# Altium schematic sheet ZeroDriftLatchComp.SchDoc: ZERO DRFT LTCH CMP
size A; PageSetup: Record=PageOptions|CenterHorizontal=True|CenterVertical=True|PrintScale=1.09|XCorrection=1.00|YCorrection=1.00|PrintKind=0|BorderSize=5000000|LeftOffset=0|BottomOffset=0|Orientation=2|PaperLength=1000|PaperWidth=1000|Scale=100|PaperSource=7|PrintQuality=-4|MediaType=1|DitherType=10|PaperKind=11" x 17"|PrintScaleMode=1; Organization: Analog Design Reference; DocumentNumber: 40000; Revision: 1; SheetNumber: 1
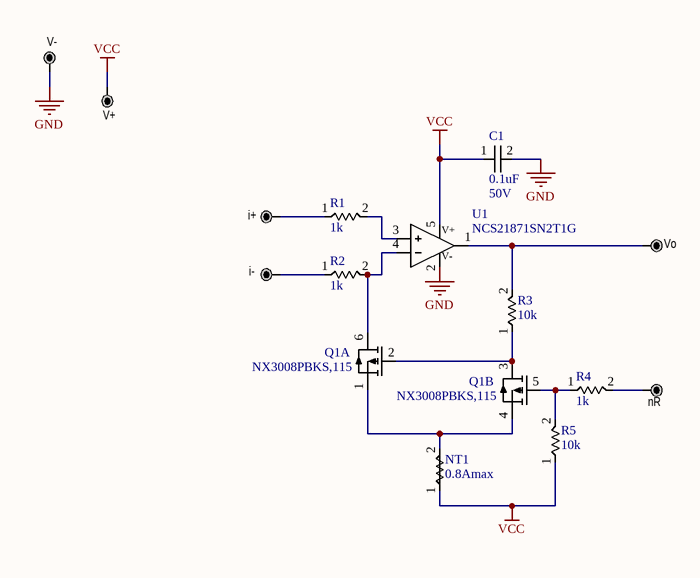
[diagram p0: ZeroDriftLatchComp.SchDoc]

## Parts
C1  0.1uF  Vendor Max Voltage: 50V  [0603 CAP]
i+  Test Point PTH  [TP - PTH]  (value not drawn)  (no BOM)
i-  Test Point PTH  [TP - PTH]  (value not drawn)  (no BOM)
nR  Test Point PTH  [TP - PTH]  (value not drawn)  (no BOM)
NT1  0.8Amax  [0603 NetTie]  (net tie, no BOM)
Q1  NX3008PBKS,115  [SOT363]  (parts A,B of 2)
R1  1k  [0603 RES]
R2  1k  [0603 RES]
R3  10k  [0603 RES]
R4  1k  [0603 RES]
R5  10k  [0603 RES]
U1  NCS21871SN2T1G  [SOT-23-5]
V+  Test Point PTH  [TP - PTH]  (value not drawn)  (no BOM)
V-  Test Point PTH  [TP - PTH]  (value not drawn)  (no BOM)
Vo  Test Point PTH  [TP - PTH]  (value not drawn)  (no BOM)

## Nets
GND: C1.2 U1.2(Vss) V-.1(TP)
VCC: C1.1 NT1.1 R5.1 U1.5(Vdd) V+.1(TP)
Neti+_1: i+.1(TP) R1.1
Neti-_1: i-.1(TP) R2.1
NetnR_1: nR.1(TP) R4.2
NetNT1_2: NT1.2 Q1.1(S) Q1.4(S)
NetQ1_2: Q1.2(G) Q1.3(D) R3.1
NetQ1_5: Q1.5(G) R4.1 R5.2
NetQ1_6: Q1.6(D) R2.2 U1.4
NetR1_2: R1.2 U1.3
NetR3_2: R3.2 U1.1 Vo.1(TP)

## Notes on the sheet
- Title
- Size:
- Date:
- A
- Number:
- Time:
- Revision:
- Sheet
- of
- File:
- (in symbol NCS21871SN2T1G) V+; V-

## Library data of the parts
C1 = C-0603-0u10-J50V-X7RC: CAP CER 0.1UF 50V X7R 0603; AltMPN1: C0603C104J5RACTU; AltMPN: GRM188R71H104JA93D; MPN: CC0603JRX7R9BB104; AltMfg1: KEMET; AltMfg: Murata; AVL: DigiKey, Mouser, Newark, Avnet, Arrow, Future, Allied, TTI, Heilind, Sager, Manufacturer Direct, Venkel; Mfg: Yageo; Tolerance: J-5%; Type: CERAMIC; Component: CAPACITOR; Value: 0.1uF; Temperature Coefficient: X7R; Design Ambient Temp (C): *; Design Ripple Current (A): *; Design Vmax RMS: *; MKS Derate Voltage (%): *; MKS Ripple Current (%): *; Vendor ESR: *; Vendor Max Power (W): *; Vendor Max Temp (C): *
i+ i- nR V+ V- Vo = Test Point PTH: PTH Test Point; VPN: *; MPN: *
NT1 = 0603_NetTie: RES 0 OHM 1/10W 1% 0603 SMD Thick Film Resistor; Newport PN: *; Value: 0.8Amax; HelpURL: http://www.smtnet.com/library/files/upload/NetTies-and-How-to-Use-Them.pdf
Q1 = NX3008PBKS,115: NX3008PBKS - 30 V, 200 mA dual P-channel Trench MOSFET; mfg: Nexperia; Supplier 1: Digi-Key; mpn: NX3008PBKS,115; RoHS: No; Stock 1: 86588; Pricing 1: 1=0.33000, 10=0.24800, 25=0.21720, 100=0.11780, 500=0.09610, 1000=0.07130 (USD); Supplier Part Number 1: 1727-1282-1-ND
R1 R2 R4 = R-0603-1K00-B-G: RES SMD 1K OHM 0.1% 1/10W 0603; MPN: RT0603BRB071KL; AltMPN: ERA-3AEB102V; AltMPN1: TFCR0603-10W-E-1001BT; Mfg: Yageo; AltMfg: Panasonic; Power: 0.1W; Tolerance: B-0.1%; AVL: DigiKey, Mouser, Newark, Avnet, Arrow, Future, Allied, TTI, Heilind, Sager, Manufacturer Direct, Venkel; AltMfg1: Venkel; HelpURL: G:\DATA\ISB Engineering\Electronics\AltiumWF\Libraries\Datasheets\Resistors\Yageo RT Series Thin Film Resistors.pdf; Value: 1k
R3 R5 = R-0603-10K0-B-G: RES SMD 10K OHM 0.1% 1/10W 0603; MPN: RT0603BRD0710KL; AltMPN: ERA-3AEB103V; AltMPN1: TFCR0603-10W-E-1002BT; Mfg: Yageo; AltMfg: Panasonic; Power: 0.1W; Tolerance: B-0.1%; AVL: DigiKey, Mouser, Newark, Avnet, Arrow, Future, Allied, TTI, Heilind, Sager, Manufacturer Direct, Venkel; AltMfg1: Venkel; HelpURL: G:\DATA\ISB Engineering\Electronics\AltiumWF\Libraries\Datasheets\Resistors\Yageo RT Series Thin Film Resistors.pdf; Value: 10k
U1 = NCS21871SN2T1G: mfg: ON Semiconductor; Supplier 1: Digi-Key; mpn: NCS21871SN2T1G; RoHS: No; Pricing 1: 2500=1.00588 (USD); Supplier Part Number 1: C316C622F2G5TA7301-ND